# EAGLE board snesram (EAGLE 5.04), part 1 of 2
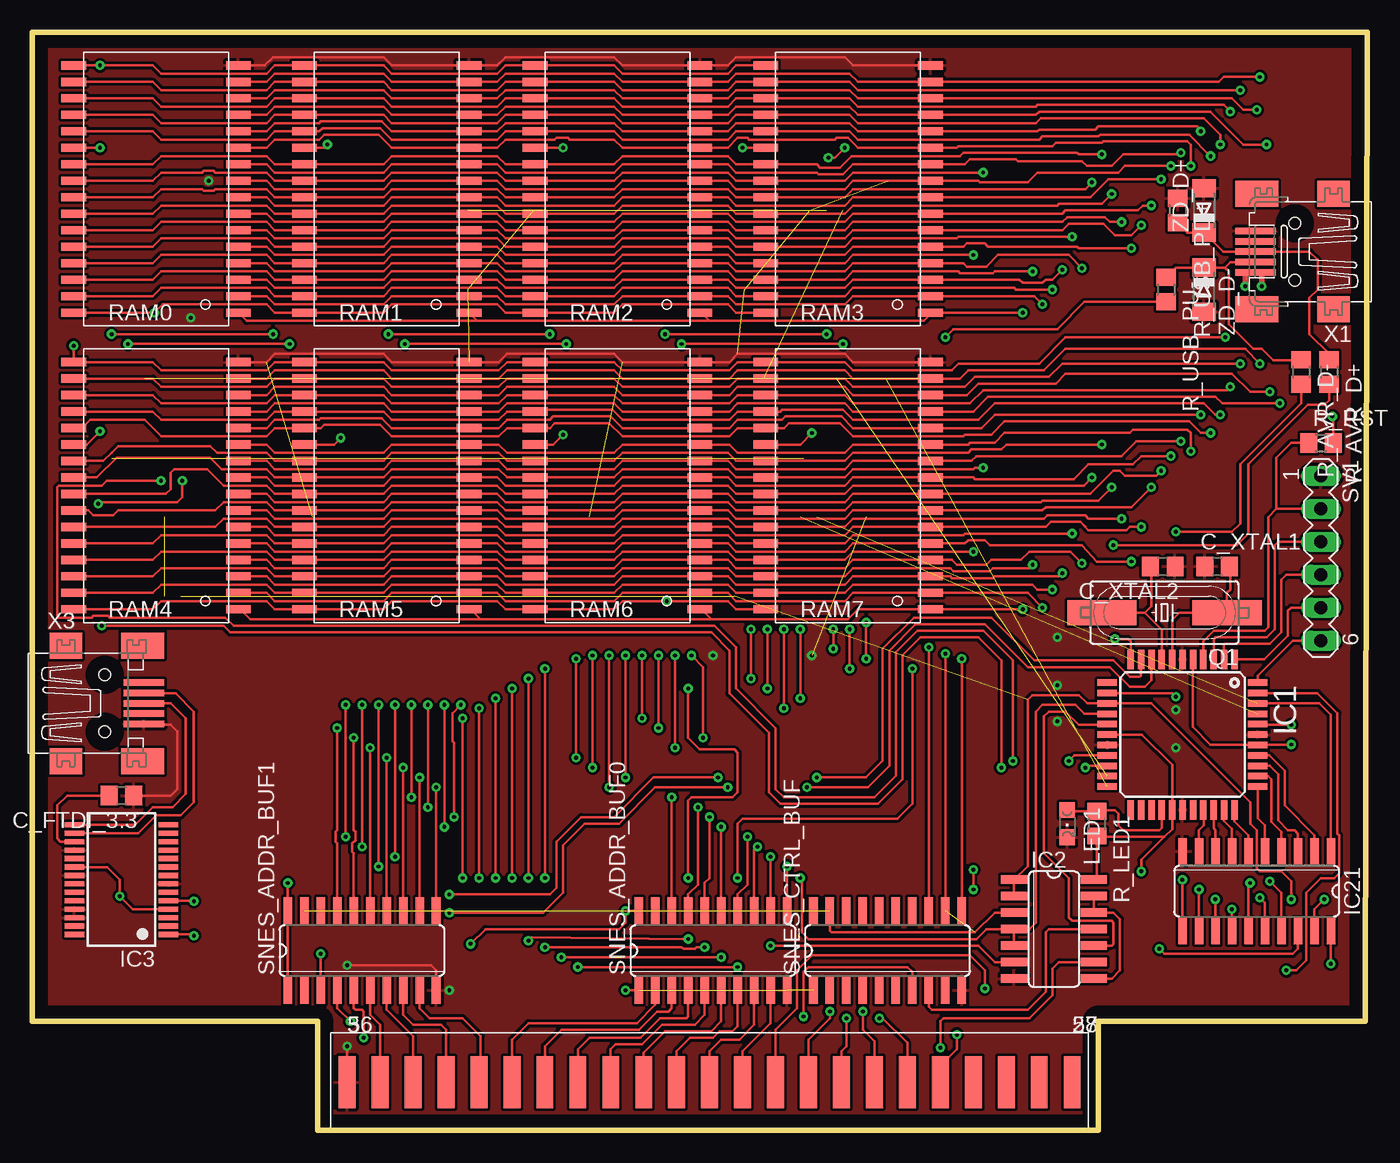
[diagram p2: board, top side]
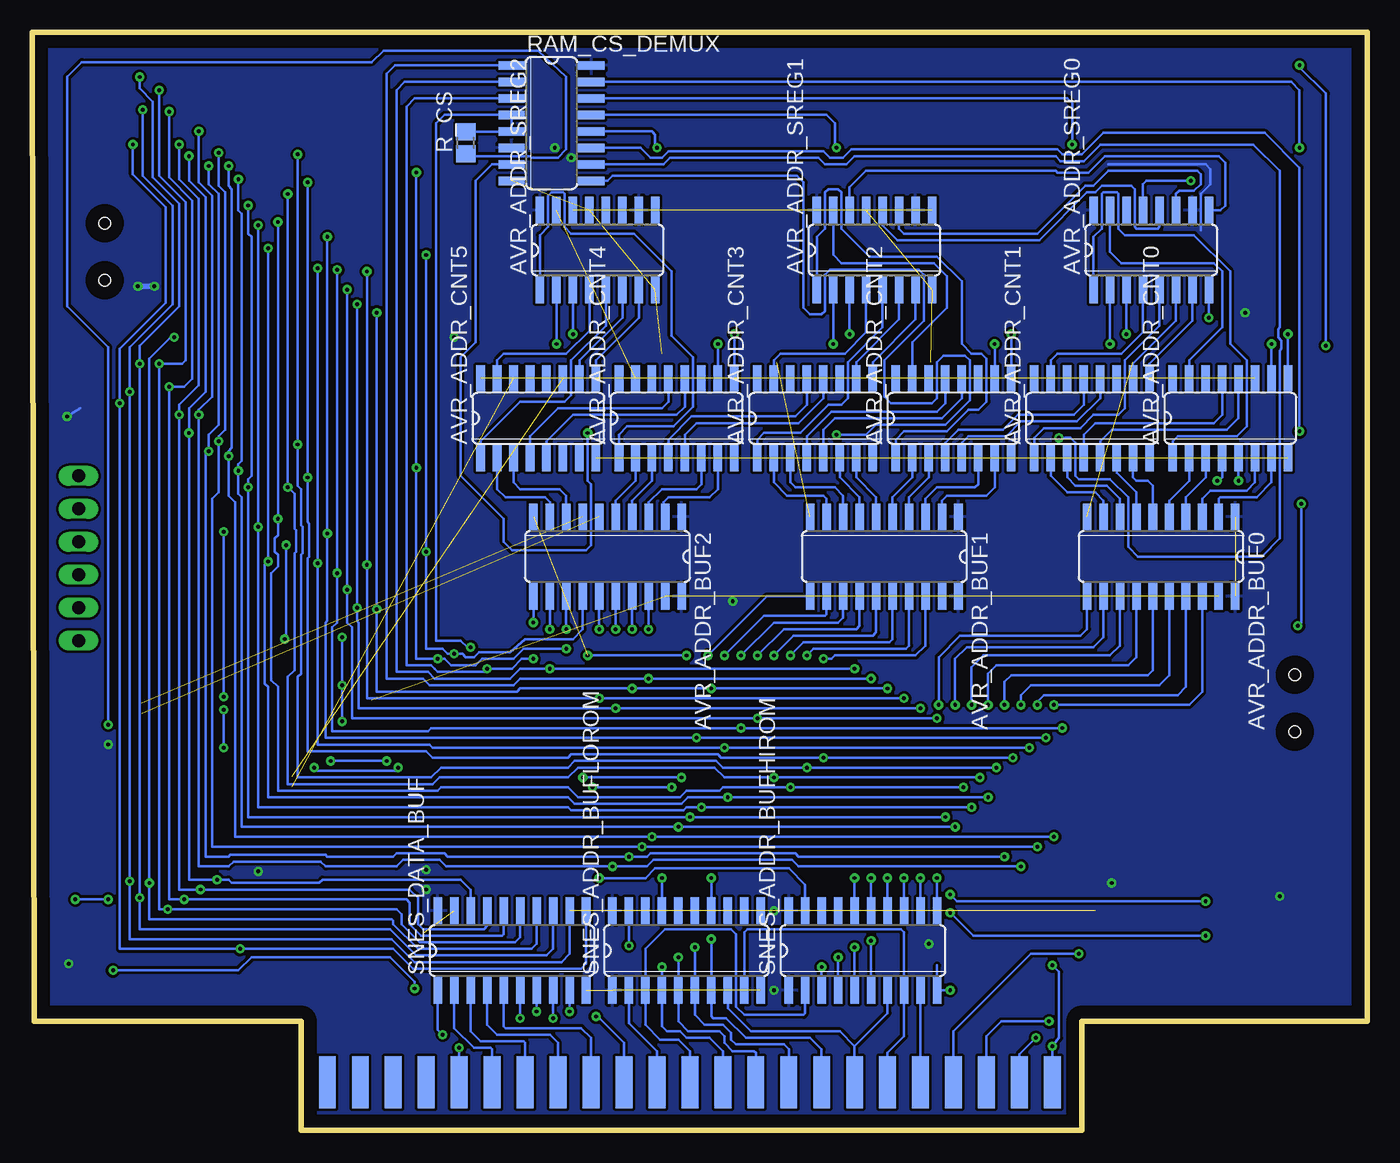
[diagram p3: board, bottom side, seen from below]

Size 102.87 x 84.58 mm. Coordinates in mm from the lower left corner, seen from the top.
Outline: 102.74,8.38 102.87,84.58 0,84.58 0,8.38 21.97,8.38 21.97,0 82.17,0 82.17,8.38 102.74,8.38
Copper layers (1*16): Top 0.035mm / dielectric 1.5mm / Bottom 0.035mm
Design rules "default *": minimum track width 8mil, minimum drill 24mil, track to track 8mil, track to pad 8mil, pad to pad 8mil, via to via 8mil, smd to smd 8mil, copper to edge 40mil, drill to drill 8mil, minimum pad ring 10mil, minimum via ring 8mil, stop-mask expansion 4mil, vias tented up to drill 0mil, thermal gap 10mil

## Footprints (pad centres in the part's own frame; a part is rotated, then mirrored left to right if it is on the bottom)
SO20 = smd 0.66 x 2.032: 1 -5.715,-3.073; 2 -4.445,-3.073; 3 -3.175,-3.073; 4 -1.905,-3.073; 5 -0.635,-3.073; 6 0.635,-3.073; 7 1.905,-3.073; 8 3.175,-3.073; 9 4.445,-3.073; 10 5.715,-3.073; 11 5.715,3.073; 12 4.445,3.073; 13 3.175,3.073; 14 1.905,3.073; 15 0.635,3.073; 16 -0.635,3.073; 17 -1.905,3.073; 18 -3.175,3.073; 19 -4.445,3.073; 20 -5.715,3.073
SO16 = smd 0.66 x 2.032: 1 -4.445,-3.073; 2 -3.175,-3.073; 3 -1.905,-3.073; 4 -0.635,-3.073; 5 0.635,-3.073; 6 1.905,-3.073; 7 3.175,-3.073; 8 4.445,-3.073; 9 4.445,3.073; 10 3.175,3.073; 11 1.905,3.073; 12 0.635,3.073; 13 -0.635,3.073; 14 -1.905,3.073; 15 -3.175,3.073; 16 -4.445,3.073
C0805 = smd 1.3 x 1.5: 1 -0.95,0; 2 0.95,0
TQFP44 = smd 1.5 x 0.5: 1 -5.8,4; 2 -5.8,3.2; 3 -5.8,2.4; 4 -5.8,1.6; 5 -5.8,0.8; 6 -5.8,0; 7 -5.8,-0.8; 8 -5.8,-1.6; 9 -5.8,-2.4; 10 -5.8,-3.2; 11 -5.8,-4; 23 5.8,-4; 24 5.8,-3.2; 25 5.8,-2.4; 26 5.8,-1.6; 27 5.8,-0.8; 28 5.8,0; 29 5.8,0.8; 30 5.8,1.6; 31 5.8,2.4; 32 5.8,3.2; 33 5.8,4 | smd 0.5 x 1.5: 12 -4,-5.8; 13 -3.2,-5.8; 14 -2.4,-5.8; 15 -1.6,-5.8; 16 -0.8,-5.8; 17 0,-5.8; 18 0.8,-5.8; 19 1.6,-5.8; 20 2.4,-5.8; 21 3.2,-5.8; 22 4,-5.8; 34 4,5.8; 35 3.2,5.8; 36 2.4,5.8; 37 1.6,5.8; 38 0.8,5.8; 39 0,5.8; 40 -0.8,5.8; 41 -1.6,5.8; 42 -2.4,5.8; 43 -3.2,5.8; 44 -4,5.8
SO14 = smd 0.66 x 2.032: 1 -3.81,-3.073; 2 -2.54,-3.073; 3 -1.27,-3.073; 4 0,-3.073; 5 1.27,-3.073; 6 2.54,-3.073; 7 3.81,-3.073; 8 3.81,3.073; 9 2.54,3.073; 10 1.27,3.073; 11 0,3.073; 12 -1.27,3.073; 13 -2.54,3.073; 14 -3.81,3.073
SSOP28 = smd 0.4 x 1.5: 1 -4.225,-3.625; 2 -3.575,-3.625; 3 -2.925,-3.625; 4 -2.275,-3.625; 5 -1.625,-3.625; 6 -0.975,-3.625; 7 -0.325,-3.625; 8 0.325,-3.625; 9 0.975,-3.625; 10 1.625,-3.625; 11 2.275,-3.625; 12 2.925,-3.625; 13 3.575,-3.625; 14 4.225,-3.625; 15 4.225,3.625; 16 3.575,3.625; 17 2.925,3.625; 18 2.275,3.625; 19 1.625,3.625; 20 0.975,3.625; 21 0.325,3.625; 22 -0.325,3.625; 23 -0.975,3.625; 24 -1.625,3.625; 25 -2.275,3.625; 26 -2.925,3.625; 27 -3.575,3.625; 28 -4.225,3.625
CHIPLED_0805 = smd 1.2 x 1.2: A 0,-1.05; C 0,1.05
HC49UP = smd 5.334 x 1.93: 1 -4.826,0; 2 4.826,0
R0805 = smd 1.3 x 1.5: 1 -0.95,0; 2 0.95,0
R0805' = smd 1.3 x 1.5: 1 -0.85,0; 2 0.85,0
SOP-32 = smd 1.905 x 0.635: 1 -6.35,9.525; 2 -6.35,8.255; 3 -6.35,6.985; 4 -6.35,5.715; 5 -6.35,4.445; 6 -6.35,3.175; 7 -6.35,1.905; 8 -6.35,0.635; 9 -6.35,-0.635; 10 -6.35,-1.905; 11 -6.35,-3.175; 12 -6.35,-4.445; 13 -6.35,-5.715; 14 -6.35,-6.985; 15 -6.35,-8.255; 16 -6.35,-9.525; 17 6.35,-9.525; 18 6.35,-8.255; 19 6.35,-6.985; 20 6.35,-5.715; 21 6.35,-4.445; 22 6.35,-3.175; 23 6.35,-1.905; 24 6.35,-0.635; 25 6.35,0.635; 26 6.35,1.905; 27 6.35,3.175; 28 6.35,4.445; 29 6.35,5.715; 30 6.35,6.985; 31 6.35,8.255; 32 6.35,9.525
MA06-1 = drill 1.016 long: 1 -6.35,0; 2 -3.81,0; 3 -1.27,0; 4 1.27,0; 5 3.81,0; 6 6.35,0
1X31_SNES_HEADER = smd 1.3 x 4: P5 -27.94,0; P6 -25.4,0; P7 -22.86,0; P8 -20.32,0; P9 -17.78,0; P10 -15.24,0; P11 -12.7,0; P12 -10.16,0; P13 -7.62,0; P14 -5.08,0; P15 -2.54,0; P16 0,0; P17 2.54,0; P18 5.08,0; P19 7.62,0; P20 10.16,0; P21 12.7,0; P22 15.24,0; P23 17.78,0; P24 20.32,0; P25 22.86,0; P26 25.4,0; P27 27.94,0
1X31_SNES_HEADERBACK = smd 1.3 x 4 bottom: 36 -27.94,0; 37 -25.4,0; 38 -22.86,0; 39 -20.32,0; 40 -17.78,0; 41 -15.24,0; 42 -12.7,0; 43 -10.16,0; 44 -7.62,0; 45 -5.08,0; 46 -2.54,0; 47 0,0; 48 2.54,0; 49 5.08,0; 50 7.62,0; 51 10.16,0; 52 12.7,0; 53 15.24,0; 54 17.78,0; 55 20.32,0; 56 22.86,0; 57 25.4,0; 58 27.94,0
32005-201 = smd 3.1 x 0.5: 1 3,1.6; 2 3,0.8; 3 3,0; 4 3,-0.8; 5 3,-1.6 | smd 2.5 x 2: M1 -3,-4.45; M2 -3,4.45 | smd 3.3 x 2: M3 2.9,4.45; M4 2.9,-4.45 | hole 0.9: 0,2.2; 0,-2.2
32005-301 = smd 3.1 x 0.5: 1 3,1.6; 2 3,0.8; 3 3,0; 4 3,-0.8; 5 3,-1.6 | smd 2.5 x 2: M1 -3,-4.45; M2 -3,4.45 | smd 3.3 x 2: M3 2.9,4.45; M4 2.9,-4.45 | hole 0.9: 0,2.2; 0,-2.2
MINIMELF = smd 1.4 x 1.8: A 1.7,0; C -1.7,0

## Placement (x,y rotation side)
AVR_ADDR_BUF0  74245  [SO20]  15.87,44.2 180 bottom
AVR_ADDR_BUF1  74245  [SO20]  37.21,44.2 180 bottom
AVR_ADDR_BUF2  74245  [SO20]  58.55,44.2 180 bottom
AVR_ADDR_CNT0  40193D  [SO16]  10.54,54.86 0 bottom
AVR_ADDR_CNT1  40193D  [SO16]  21.21,54.86 0 bottom
AVR_ADDR_CNT2  40193D  [SO16]  31.88,54.86 0 bottom
AVR_ADDR_CNT3  40193D  [SO16]  42.54,54.86 0 bottom
AVR_ADDR_CNT4  40193D  [SO16]  53.21,54.86 0 bottom
AVR_ADDR_CNT5  40193D  [SO16]  63.88,54.86 0 bottom
AVR_ADDR_SREG0  74HCT595D  [SO16]  16.64,67.82 0 bottom
AVR_ADDR_SREG1  74HCT595D  [SO16]  37.97,67.82 0 bottom
AVR_ADDR_SREG2  74HCT595D  [SO16]  59.31,67.82 0 bottom
C_FTDI_3.3  100n  [C0805]  6.86,25.78 180 top
C_XTAL1  22p  [C0805]  91.31,43.43 0 top
C_XTAL2  22p  [C0805]  87.12,43.43 180 top
IC1  ATMEGA644A  [TQFP44]  88.65,30.48 270 top
IC2  74S00D  [SO14]  78.74,15.49 270 top
IC3  FT232RL  [SSOP28]  6.86,19.3 90 top
IC21  74245  [SO20]  94.36,18.41 180 top
LED1  [CHIPLED_0805]  79.76,23.62 180 top
Q1  [HC49UP]  87.25,39.88 180 top
R_AVR_D+  68  [R0805]  99.95,58.42 270 top
R_AVR_D-  68  [R0805]  97.79,58.42 270 top
R_CS  200?!  [R0805']  69.47,76.07 90 bottom
R_LED1  1k6  [R0805]  82.04,23.62 270 top
R_RST  4k7  [R0805]  99.31,52.96 0 top
R_USB_PD+  1M  [R0805]  88.27,70.87 270 top
R_USB_PU-  1k5  [R0805]  87.38,64.77 270 top
RAM0  KM628512-XX  [SOP-32]  9.52,72.52 180 top
RAM1  KM628512-XX  [SOP-32]  27.3,72.52 180 top
RAM2  KM628512-XX  [SOP-32]  45.09,72.52 180 top
RAM3  KM628512-XX  [SOP-32]  62.86,72.52 180 top
RAM4  KM628512-XX  [SOP-32]  9.52,49.66 180 top
RAM5  KM628512-XX  [SOP-32]  27.3,49.66 180 top
RAM6  KM628512-XX  [SOP-32]  45.09,49.66 180 top
RAM7  KM628512-XX  [SOP-32]  62.86,49.66 180 top
RAM_CS_DEMUX  74LS138D  [SO16]  62.86,77.6 270 bottom
SNES_ADDR_BUF0  74245  [SO20]  52.45,13.84 0 top
SNES_ADDR_BUF1  74245  [SO20]  25.4,13.84 0 top
SNES_ADDR_BUFHIROM  74245  [SO20]  38.86,13.84 0 bottom
SNES_ADDR_BUFLOROM  74245  [SO20]  52.45,13.84 0 bottom
SNES_CTRL_BUF  74245  [SO20]  65.91,13.84 0 top
SNES_DATA_BUF  74245  [SO20]  65.91,13.84 0 bottom
SV1  [MA06-1]  99.31,44.07 270 top
U$1  SNES_CON_1  [1X31_SNES_HEADER]  52.2,3.68 0 top
U$2  SNES_CON_2  [1X31_SNES_HEADERBACK]  52.2,3.68 0 top
X1  MINI-USB  [32005-201]  97.28,67.69 180 top
X3  MINI-USB-32005-301  [32005-301]  5.59,32.89 0 top
ZD_D+  3.6V  [MINIMELF]  90.3,70.87 90 top
ZD_D-  3.6V  [MINIMELF]  90.3,64.77 270 top